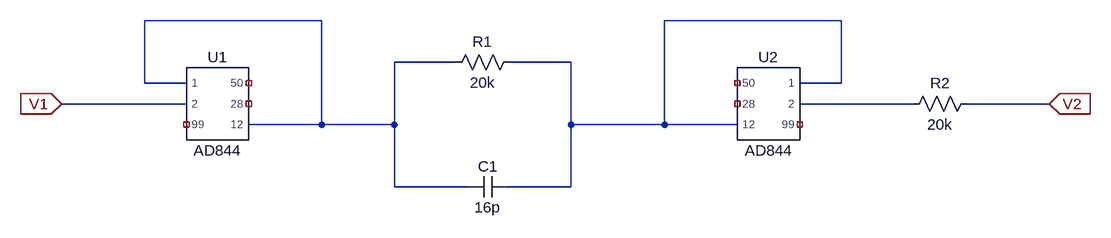
[diagram p0: schematic floating_inductor__bonus.asc]
floating_inductor__bonus.asc, the LTspice schematic file:
Version 4
SHEET 1 880 680
WIRE -736 112 -1008 112
WIRE 64 112 -208 112
WIRE -528 176 -624 176
WIRE -352 176 -448 176
WIRE -1008 208 -1008 112
WIRE -944 208 -1008 208
WIRE 64 208 64 112
WIRE 64 208 0 208
WIRE -944 240 -1136 240
WIRE 176 240 0 240
WIRE 384 240 256 240
WIRE -736 272 -736 112
WIRE -736 272 -848 272
WIRE -624 272 -624 176
WIRE -624 272 -736 272
WIRE -352 272 -352 176
WIRE -208 272 -208 112
WIRE -208 272 -352 272
WIRE -96 272 -208 272
WIRE -624 368 -624 272
WIRE -512 368 -624 368
WIRE -352 368 -352 272
WIRE -352 368 -448 368
FLAG -1136 240 V1
IOPIN -1136 240 In
FLAG 384 240 V2
IOPIN 384 240 In
SYMBOL cap -448 352 R90
WINDOW 0 0 32 VBottom 2
WINDOW 3 32 32 VTop 2
SYMATTR InstName C1
SYMATTR Value 16p
SYMBOL res -432 160 R90
WINDOW 0 0 56 VBottom 2
WINDOW 3 32 56 VTop 2
SYMATTR InstName R1
SYMATTR Value 20k
SYMBOL res 272 224 R90
WINDOW 0 0 56 VBottom 2
WINDOW 3 32 56 VTop 2
SYMATTR InstName R2
SYMATTR Value 20k
SYMBOL AD844 -896 240 R0
SYMATTR InstName U1
SYMBOL AD844 -48 240 M0
SYMATTR InstName U2

The netlist it stands for:
* floating_inductor__bonus.asc
C1 N002 N001 16p
R1 N002 N001 20k
R2 V2 N003 20k
XU1 N001 V1 NC_01 NC_02 NC_03 N001 AD844  ; pins 1 2 99 50 28 12
XU2 N002 N003 NC_04 NC_05 NC_06 N002 AD844  ; pins 1 2 99 50 28 12
.lib C:\Users\Aras Güngöre\Documents\LTspiceXVII\Projeler\Proje 2 - Current Conveyor\ad844.cir
.backanno
.end